# Altium schematic sheet Usb to Uart.SchDoc
size A4; SheetNumber: 8; SheetTotal: 22
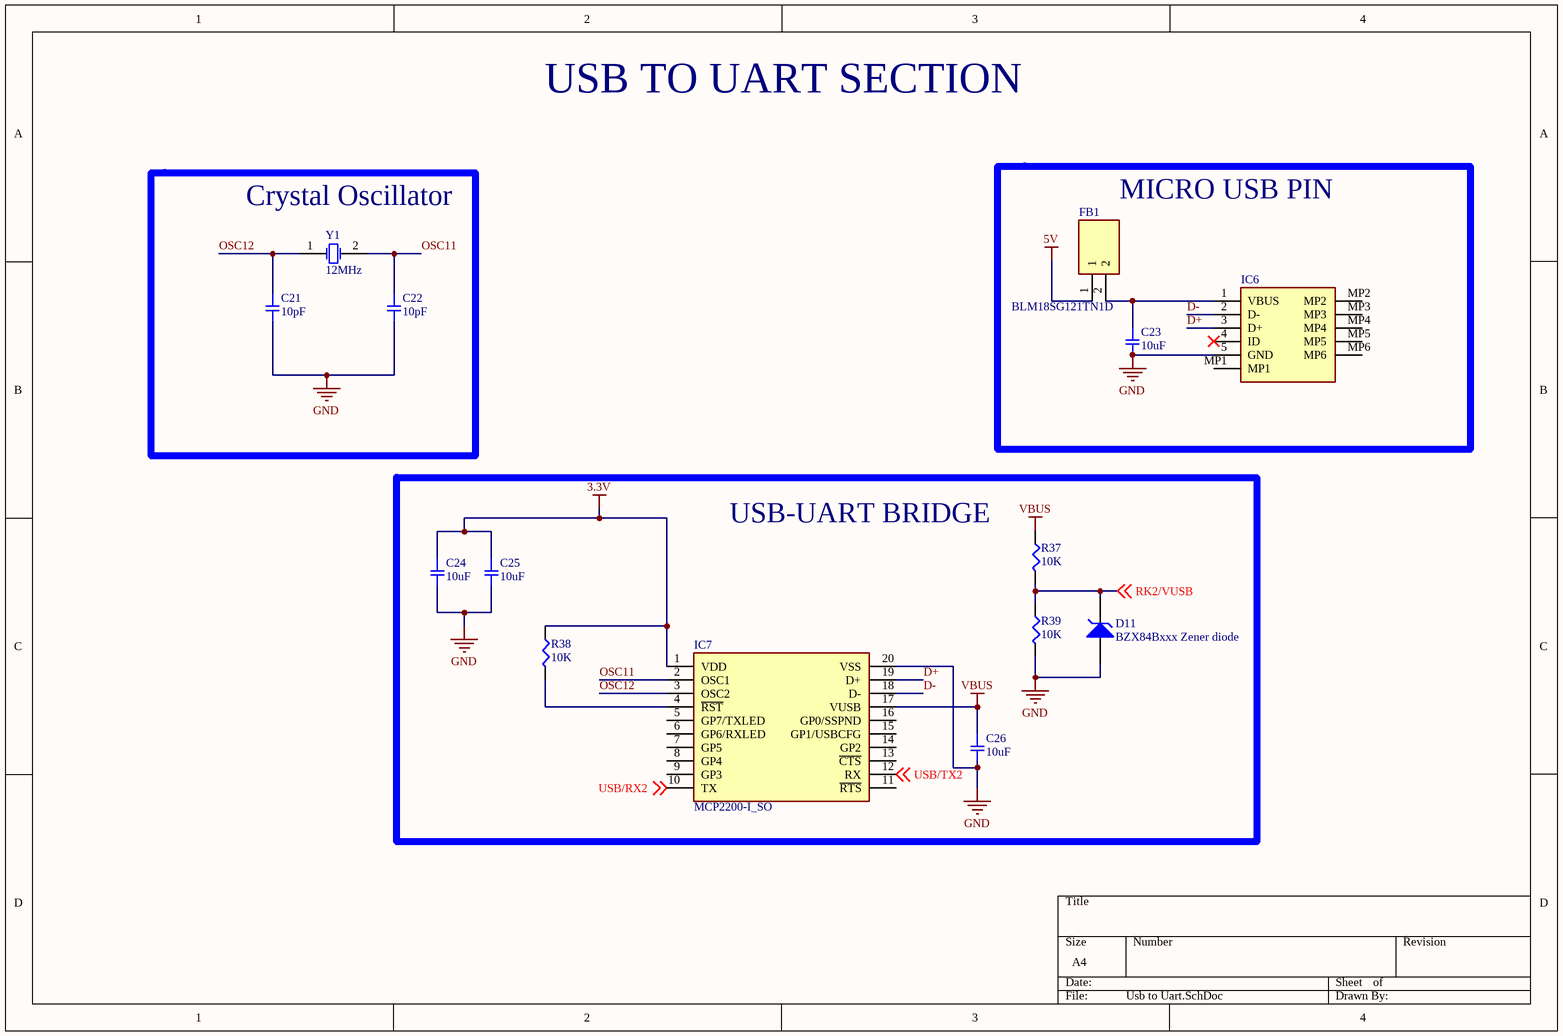
[diagram p0: Usb to Uart.SchDoc]

## Parts
C21  10pF  [SMD-0805C]
C22  10pF  [SMD-0805C]
C23  10uF  [SMD-0805C]
C24  10uF  [SMD-0805C]
C25  10uF  [SMD-0805C]
C26  10uF  [SMD-0805C]
D11  BZX84Bxxx Zener diode  [SOT95P240X120-3N]
FB1  BLM18SG121TN1D  [BLM18EG101TH1D]
IC6  (no value)  [0473461001]
IC7  MCP2200-I_SO  [SOIC127P1030X265-20N]
R37  10K  [SMD-0805-RES]
R38  10K  [SMD-0805-RES]
R39  10K  [SMD-0805-RES]
Y1  12MHz  [Mini Crystal]

## Blocks framed on the sheet
Crystal Oscillator: C21 C22 Y1
MICRO USB PIN: C23 FB1 IC6
USB-UART BRIDGE: C24-C26 D11 IC7 R37-R39

## Nets
3.3V: C24.1 C25.1 IC7.1(VDD) R38.1
5V: FB1.1
GND: C21.2 C22.2 C23.2 C24.2 C25.2 C26.2 D11.1(A) IC6.5(GND) IC7.20(VSS) R39.2
VBUS: C26.1 IC7.17(VUSB) R37.1
D+: IC6.3(D+) IC7.19(D+)
D-: IC6.2(D-) IC7.18(D-)
OSC11: C22.1 IC7.2(OSC1) Y1.2(X2)
OSC12: C21.1 IC7.3(OSC2) Y1.1(X1)
RK2/VUSB: D11.3(K) R37.2 R39.1 ; off-sheet RK2/VUSB
USB/RX2: IC7.10(TX) ; off-sheet USB/RX2
USB/TX2: IC7.12(RX) ; off-sheet USB/TX2
NetC23_1: C23.1 FB1.2 IC6.1(VBUS)
NetIC7_4: IC7.4(~{RST}) R38.2

Not connected (* = marked no-connect by the designer): IC6 4(ID)* MP1 MP2 MP3 MP4 MP5 MP6; IC7 5(GP7/TXLED) 6(GP6/RXLED) 7(GP5) 8(GP4) 9(GP3) 11(~{RTS}) 13(~{CTS}) 14(GP2) 15(GP1/USBCFG) 16(GP0/SSPND)

## Notes on the sheet
- USB TO UART SECTION

## Library data of the parts
C21-C26 = GCD21BR71H104KA01L: CAP CER 0.1UF 50V X7R 0805; Manufacturer: Murata Electronics North America; Factory Stock: 0; Unit Price (USD): 0.24; Minimum Quantity: 1; Value: 0.10µF; Tolerance: ±10%; Datasheets: http://www.murata.com/~/media/webrenewal/support/library/catalog/products/capacitor/mlcc/c03e.ashx; Image: //media.digikey.com/Renders/Murata%20Renders/0805%28GxM6%29.jpg; Digi-Key Part Number: 490-11955-1-ND; Part Number: GCD21BR71H104KA01L; Quantity Available: 157; @ qty: 0; Packaging: Cut Tape (CT); Series: GCD; Part Status: Active; Voltage: 50V; Temperature Coefficient: X7R; Operating Temperature: -55°C ~ 125°C; Features: -; Ratings: AEC-Q200; Applications: Automotive; Mounting Type: Surface Mount, MLCC; Package / Case: 0805 (2012 Metric); Size / Dimension: 0.079" L x 0.049" W (2.00mm x 1.25mm); Height - Seated (Max): -; Thickness (Max): 0.049" (1.25mm); Lead Spacing: -; Lead Style: -
D11 = BZX84Bxxx Zener diode: BZX84Bxxx SMD Zener Diode SOT-23
FB1 = BLM18SG121TN1D: Ferrite Bead; Manufacturer_Name: Murata Electronics; Datasheet Link: http://www.murata.com/~/media/webrenewal/support/library/catalog/products/emc/emifil/c31e.ashx?la=en-gb; Height: 0.75mm; Manufacturer_Part_Number: BLM18SG121TN1D; Mouser Part Number: 81-BLM18SG121TN1D; Mouser Price/Stock: https://www.mouser.co.uk/ProductDetail/Murata-Electronics/BLM18SG121TN1D?qs=OMB6gcCnelWdy%252B7xRA0fBw%3D%3D; Arrow Part Number: BLM18SG121TN1D; Arrow Price/Stock: https://www.arrow.com/en/products/blm18sg121tn1d/murata-manufacturing?region=nac
IC6 = 0473461001: Connector; Manufacturer_Name: Molex; Datasheet Link: https://componentsearchengine.com/Datasheets/1/0473461001.pdf; Height: 2.45mm; Manufacturer_Part_Number: 0473461001; Mouser Part Number: N/A; Mouser Price/Stock: https://www.mouser.co.uk/ProductDetail/Molex/0473461001?qs=2bnkQPT%252BPafTZgGVt%2FOGfA%3D%3D; Arrow Part Number: 0473461001; Arrow Price/Stock: https://www.arrow.com/en/products/0473461001/molex?region=nac
IC7 = MCP2200-I_SO: Integrated Circuit; Manufacturer_Name: Microchip; Manufacturer_Part_Number: MCP2200-I/SO; Datasheet Link: https://datasheet.datasheetarchive.com/originals/distributors/Datasheets-DGA2/214544.pdf; Height: 2.65mm; Mouser Part Number: 579-MCP2200-I/SO; Mouser Price/Stock: https://www.mouser.co.uk/ProductDetail/Microchip-Technology-Atmel/MCP2200-I-SO?qs=kI7nsUnms46fN8L9VZlJCA%3D%3D; Arrow Part Number: MCP2200-I/SO; Arrow Price/Stock: https://www.arrow.com/en/products/mcp2200-iso/microchip-technology?region=nac
R37-R39 = ERJ-6ENF1001V: RES SMD 1K OHM 1% 1/8W 0805; Manufacturer: Panasonic Electronic Components; Factory Stock: 0; Unit Price (USD): 0.00729; @ qty: 1500; Minimum Quantity: 1; Power (Watts): 0.125W, 1/8W; Temperature Coefficient: ±100ppm/°C; Part Number: ERJ-6ENF1001V; Datasheets: http://industrial.panasonic.com/www-cgi/jvcr13pz.cgi?E+PZ+3+AOA0002+ERJ6ENF1001V+7+WW; Image: //media.digikey.com/Renders/Panasonic%20Renders/ERJ-0805%20Pkg.jpg; Digi-Key Part Number: P1.00KCCT-ND; Quantity Available: 12895103; Packaging: Cut Tape (CT); Series: ERJ; Part Status: Active; Value: 1k; Tolerance: ±1%; Composition: Thick Film; Features: Automotive AEC-Q200; Operating Temperature: -55°C ~ 155°C; Package / Case: 0805 (2012 Metric); Supplier Device Package: 0805; Size / Dimension: 0.079" L x 0.049" W (2.00mm x 1.25mm); Height - Seated (Max): 0.028" (0.70mm); Number of Terminations: 2; Failure Rate: -
Y1 = Mini Crystal: 9B-64.000MBBK-B; Manufacturer: Abracon; PartNumber: ABLS2-4.096MHZ-D4Y-T; Operation Mode: Fundamental or 3rd Overtone; Shunt Capacitance: 7 pF Max.; Freq. Stability: +/- 30 ppm; Packing: Tape and Reel; ESR: 180 Ohm; Load Capacitance: 18 pF; Frequency: 4.096 MHz; Mounting Technology: Surface Mount; PackageDescription: 2-Pin SMD, Body 11.4 x 4.7 mm, Height 3.3 mm; ComponentLink1URL: http://www.abracon.com/; ComponentLink2Description: Datasheet; Operating Temp. Range: -40 to 85 degC; RoHS: TRUE; PackageReference: ABLS2-2; DatasheetVersion: Rev. 03.31.11; Freq. Tolerance: +/- 30 ppm; ComponentLink2URL: http://www.abracon.com/Resonators/ABLS2.pdf; ComponentLink1Description: Manufacturer URL